# Altium schematic sheet 30to50V-24V_10A.SchDoc: 50V-24V Buck Converter @ 10A
size 279 x 215 mm; Date: 2023-07-16; CheckedBy: Logan Hartford; Engineer: Muhammad Tanveer; Revision: 1; SheetNumber: 1; SheetTotal: 1
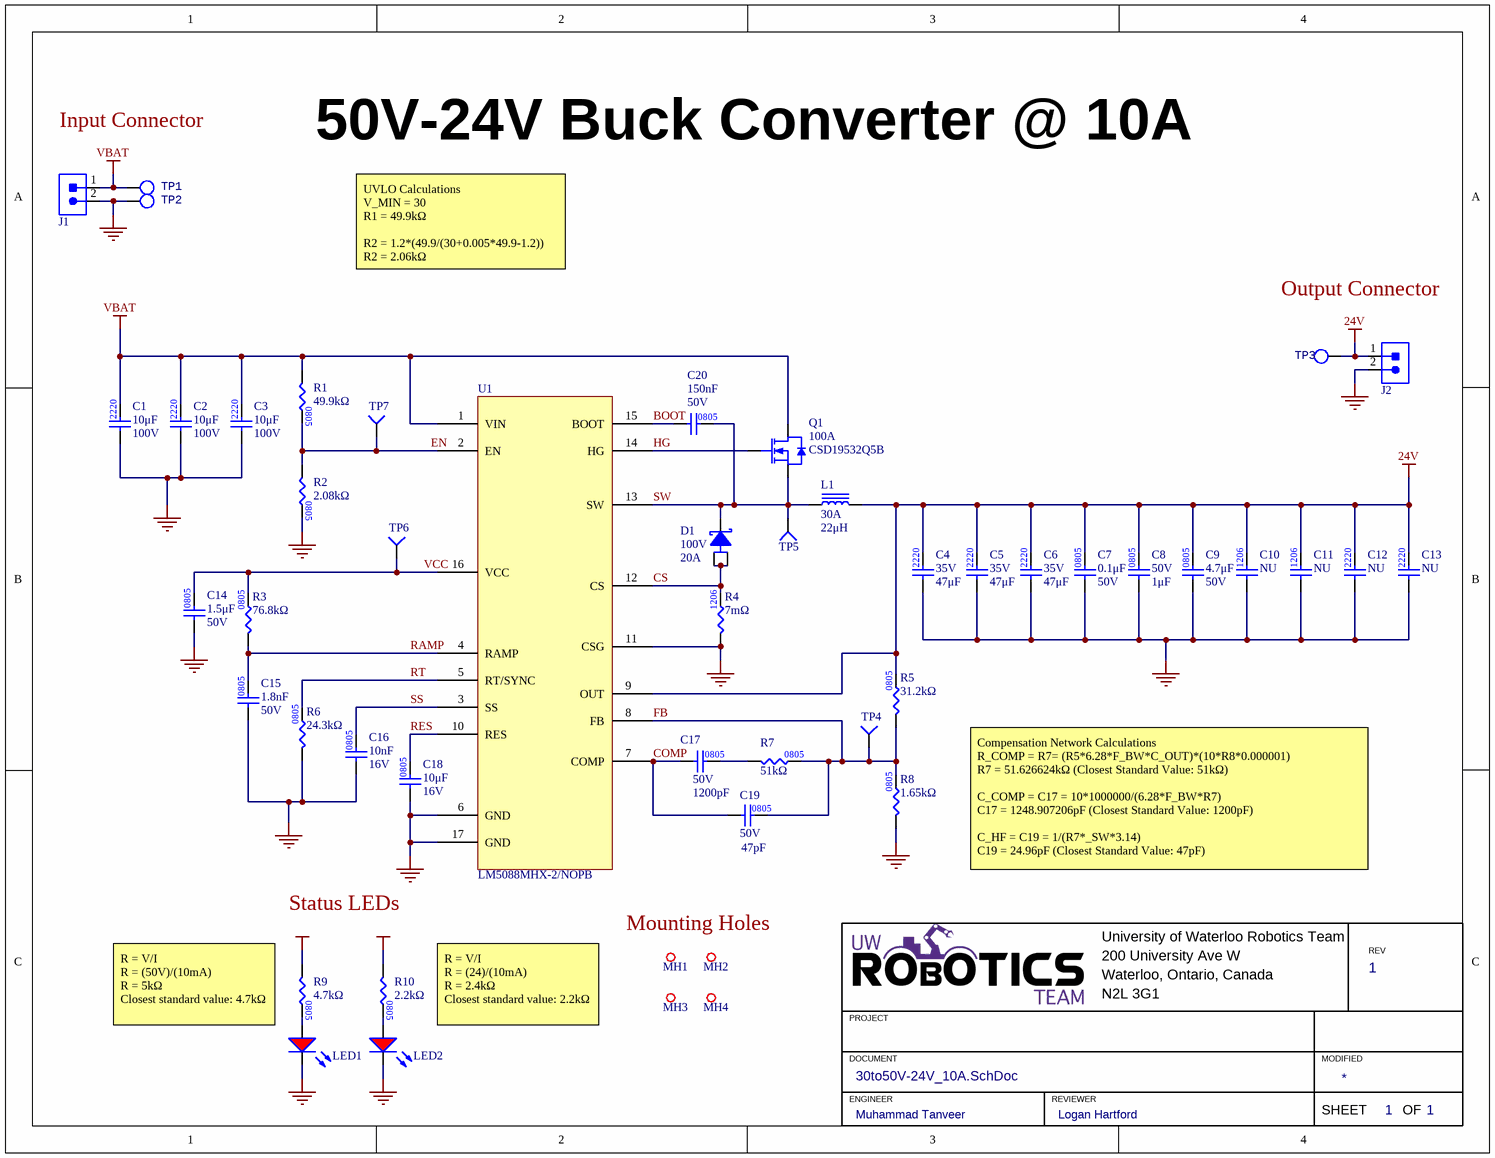
[diagram p0: 30to50V-24V_10A.SchDoc]

## Parts
C1  value 10μF  Voltage Rating: 100V  [CAP2220]  (hidden comment: CAP_10uF_50V_2220)
C2  value 10μF  Voltage Rating: 100V  [CAP2220]  (hidden comment: CAP_10uF_50V_2220)
C3  value 10μF  Voltage Rating: 100V  [CAP2220]  (hidden comment: CAP_10uF_50V_2220)
C4  value 47μF  Voltage Rating: 35V  [CAP2220]  (hidden comment: CAP_47uF_35V_2220)
C5  value 47μF  Voltage Rating: 35V  [CAP2220]  (hidden comment: CAP_47uF_35V_2220)
C6  value 47μF  Voltage Rating: 35V  [CAP2220]  (hidden comment: CAP_47uF_35V_2220)
C7  value 0.1μF  Voltage Rating: 50V  [CAP0805]  (hidden comment: CAP_0.1uF_50V_0805)
C8  value 1μF  Voltage Rating: 50V  [CAP0805]  (hidden comment: CAP_1uF_50V_0805)
C9  value 4.7μF  Voltage Rating: 50V  [CAP0805]  (hidden comment: CAP_4.7uF_50V_0805)
C10  value NU  [CAP1206]  (hidden comment: CAP_NU_1206)
C11  value NU  [CAP1206]  (hidden comment: CAP_NU_1206)
C12  value NU  [CAP2220]  (hidden comment: CAP_NU_2220)
C13  value NU  [CAP2220]  (hidden comment: CAP_NU_2220)
C14  value 1.5μF  Voltage Rating: 50V  [CAP0805]  (hidden comment: CAP_1.5uF_50V_0805)
C15  value 1.8nF  Voltage Rating: 50V  [CAP0805]  (hidden comment: CAP_1.8nF_50V_0805)
C16  value 10nF  Voltage Rating: 16V  [CAP0805]  (hidden comment: CAP_10nF_16V_0805)
C17  value 1200pF  Voltage Rating: 50V  [CAP0805]  (hidden comment: CAP_1200pF_50V_0805)
C18  value 10μF  Voltage Rating: 16V  [CAP0805]  (hidden comment: CAP_10uF_16V_0805)
C19  value 47pF  Voltage Rating: 50V  [CAP0805]  (hidden comment: CAP_47pF_50V_0805)
C20  value 150nF  Voltage Rating: 50V  [CAP0805]  (hidden comment: CAP_150nF_50V_0805)
D1  Vr (Max): 100V  Forward Current: 20A  [D2PAK (TO-263AB) - STPS20M100SG-TR]  (hidden comment: DIO_SCHOTTKY_100V_20A)
J1  CON_2POS_SCREW_TERM  [1935161]  (value not drawn)
J2  CON_2POS_SCREW_TERM  [1935161]  (value not drawn)
L1  Current Rating: 30A  Inductance: 22μH  [7443642200]  (hidden comment: IND_22uH_30A)
LED1  LED_RED  [LED_0805_RED]  (value not drawn)
LED2  LED_RED  [LED_0805_RED]  (value not drawn)
MH1  MOUNTING_HOLE_M3_GIMBAL_REV2  [MOUNTING_HOLE_3mm_GIMBAL_REV2]  (value not drawn)  (no BOM)
MH2  MOUNTING_HOLE_M3_GIMBAL_REV2  [MOUNTING_HOLE_3mm_GIMBAL_REV2]  (value not drawn)  (no BOM)
MH3  MOUNTING_HOLE_M3_GIMBAL_REV2  [MOUNTING_HOLE_3mm_GIMBAL_REV2]  (value not drawn)  (no BOM)
MH4  MOUNTING_HOLE_M3_GIMBAL_REV2  [MOUNTING_HOLE_3mm_GIMBAL_REV2]  (value not drawn)  (no BOM)
Q1  Id: 100A  Manufacturer Part Number 1: CSD19532Q5B  [8-VSON]  (hidden comment: NMOS_100V_100A)
R1  value 49.9kΩ  [RES0805]  (hidden comment: RES_49.9kΩ_0805_1%)
R2  value 2.08kΩ  [RES0805]  (hidden comment: RES_2.08kΩ_0805_0.05%)
R3  value 76.8kΩ  [RES0805]  (hidden comment: RES_76.8kΩ_0805_1%)
R4  value 7mΩ  [RES1206]  (hidden comment: RES_0.007Ω_1206_1%)
R5  value 31.2kΩ  [RES0805]  (hidden comment: RES_31.2KΩ_0805_0.1%)
R6  value 24.3kΩ  [RES0805]  (hidden comment: RES_24.3kΩ_0805_1%)
R7  value 51kΩ  [RES0805]  (hidden comment: RES_51kΩ_0805_5%)
R8  value 1.65kΩ  [RES0805]  (hidden comment: RES_1.65KΩ_0805_0.1%)
R9  value 4.7kΩ  [RES0805]  (hidden comment: RES_4.7kΩ_0805_5%)
R10  value 2.2kΩ  [RES0805]  (hidden comment: RES_2.2kΩ_0805_5%)
TP1  TESTPOINT_LOOP  [TESTPOINT_LOOP]  (value not drawn)
TP2  TESTPOINT_LOOP  [TESTPOINT_LOOP]  (value not drawn)
TP3  TESTPOINT_LOOP  [TESTPOINT_LOOP]  (value not drawn)
TP4  TESTPOINT_1MM_CIRCLE  [TESTPOINT_CIRCLE_1MM]  (value not drawn)  (no BOM)
TP5  TESTPOINT_1MM_CIRCLE  [TESTPOINT_CIRCLE_1MM]  (value not drawn)  (no BOM)
TP6  TESTPOINT_1MM_CIRCLE  [TESTPOINT_CIRCLE_1MM]  (value not drawn)  (no BOM)
TP7  TESTPOINT_1MM_CIRCLE  [TESTPOINT_CIRCLE_1MM]  (value not drawn)  (no BOM)
U1  LM5088  [LM5088]  (value not drawn)

## Nets
24V: C4.2 C5.2 C6.2 C7.2 C8.2 C9.2 C10.2 C11.2 C12.2 C13.2 J2.1 L1.2 R5.2 R10.1 TP3.1 U1.9(OUT)
GND: C1.1 C2.1 C3.1 C4.1 C5.1 C6.1 C7.1 C8.1 C9.1 C10.1 C11.1 C12.1 C13.1 C14.1 C15.1 C16.1 C18.1 J1.2 J2.2 LED1.2(K) LED2.2(K) R2.2 R4.1 R6.1 R8.1 TP2.1 U1.6(GND) U1.11(CSG) U1.17(GND)
VBAT: C1.2 C2.2 C3.2 J1.1 Q1.3(Drain) R1.1 R9.1 TP1.1 U1.1(VIN)
BOOT: C20.1 U1.15(BOOT)
COMP: C17.1 C19.1 U1.7(COMP)
CS: D1.1(Anode) D1.2(Anode) R4.2 U1.12(CS)
EN: R1.2 R2.1 TP7.1(=value) U1.2(EN)
FB: C19.2 R5.1 R7.2 R8.2 TP4.1(=value) U1.8(FB)
HG: Q1.1(Gate) U1.14(HG)
RAMP: C15.2 R3.1 U1.4(RAMP)
RES: C18.2 U1.10(RES)
RT: R6.2 U1.5(RT/SYNC)
SS: C16.2 U1.3(SS)
SW: C20.2 D1.3(Cathode) L1.1 Q1.2(Source) TP5.1(=value) U1.13(SW)
VCC: C14.2 R3.2 TP6.1(=value) U1.16(VCC)
NetC17_2: C17.2 R7.1
NetLED1_1: LED1.1(A) R9.2
NetLED2_1: LED2.1(A) R10.2

## Notes on the sheet
- Input Connector
- UVLO Calculations
  V_MIN = 30
  R1 = 49.9kΩ
  R2 = 1.2*(49.9/(30+0.005*49.9-1.2))
  R2 = 2.06kΩ
- Output Connector
- Status LEDs
- Compensation Network Calculations
  R_COMP = R7= (R5*6.28*F_BW*C_OUT)*(10*R8*0.000001)
  R7 = 51.626624kΩ (Closest Standard Value: 51kΩ)
  C_COMP = C17 = 10*1000000/(6.28*F_BW*R7)
  C17 = 1248.907206pF (Closest Standard Value: 1200pF)
  C_HF = C19 = 1/(R7*_SW*3.14)
  C19 = 24.96pF (Closest Standard Value: 47pF)
- Mounting Holes
- R = V/I
  R = (50V)/(10mA)
  R = 5kΩ
  Closest standard value: 4.7kΩ
- R = V/I
  R = (24)/(10mA)
  R = 2.4kΩ
  Closest standard value: 2.2kΩ
- University of Waterloo Robotics Team
- 200 University Ave W
- REV
- PROJECT
- Waterloo, Ontario, Canada
- N2L 3G1
- DOCUMENT
- ENGINEER
- REVIEWER
- MODIFIED
- SHEET
- OF
- (in symbol CAP_1.5uF_50V_0805) 0805
- (in symbol CAP_1.8nF_50V_0805) 0805
- (in symbol CAP_10nF_16V_0805) 0805
- (in symbol CAP_10uF_50V_2220) 2220
- (in symbol CAP_150nF_50V_0805) 0805
- (in symbol CAP_NU_2220) 2220
- (in symbol RES_51kΩ_0805_5%) 0805
- (in symbol RES_76.8kΩ_0805_1%) 0805

## Library data of the parts
C1-C3 = CAP_10uF_50V_2220: CAP CER 10UF 100V X7S 2220; Manufacturer 1: TDK Corporation; Manufacturer Part Number 1: C5750X7S2A106K230KB; Dielectric: X7S; Supplier 1: Digi-Key; Supplier Part Number 1: 445-13408-1-ND
C4-C6 = CAP_47uF_35V_2220: CAP CER 47UF 35V X7R 2220; Manufacturer 1: TDK Corporation; Manufacturer Part Number 1: CGA9N1X7R1V476M230KC; Package/Footprint: 2220; Supplier 1: Digi-Key; Supplier Part Number 1: 445-CGA9N1X7R1V476M230KCCT-ND; Mounting Type: SMD
C7 = CAP_0.1uF_50V_0805: CAP CER 0.1UF 50V X7R 0805; Manufacturer 1: Murata Electronics; Manufacturer Part Number 1: GCM21BR71H104KA37K; Package/Footprint: 0805; Mounting Type: SMD; Supplier 1: Digi-Key; Supplier Part Number 1: 490-8049-1-ND; Dielectric: X7R; LCSC Part #: C49678
C8 = CAP_1uF_50V_0805: CAP CER 1UF 50V X7R 0805; Manufacturer Part Number 1: CL21B105KBFNNNG; Manufacturer 1: Samsung Electro-Mechanics; Supplier Part Number 1: 1276-6470-1-ND; Supplier 1: Digi-Key; Mounting Type: SMD; LCSC Part #: C28323; Package: 0805
C9 = CAP_4.7uF_50V_0805: CAP CER 4.7UF 50V X5R 0805; Manufacturer 1: TDK Corporation; Manufacturer Part Number 1: CGA4J3X5R1H475K125AB; Mounting Type: SMD; Supplier 1: Digi-Key; Supplier Part Number 1: 445-7882-1-ND; Package: 0805; LCSC Part #: C1779; Dielectric: X5R
C10 C11 = CAP_NU_1206: PLACEHOLDER CAPACITOR; Mounting Type: Surface Mount; Package: 1206
C12 C13 = CAP_NU_2220: PLACEHOLDER CAPACITOR; Mounting Type: Surface Mount; Package: 1206
C14 = CAP_1.5uF_50V_0805: CAP CER 1.5UF 50V X7R 0805; Manufacturer Part Number 1: C2012X7R1H155K125AC; Manufacturer 1: TDK Corporation; Supplier Part Number 1: C2012X7R1H155K125AC; Supplier 1: Digi-Key; Dielectric: X7R
C15 = CAP_1.8nF_50V_0805: CAP CER 1800PF 50V C0G/NP0 0805; Manufacturer Part Number 1: GRM2165C1H182JA01D; Manufacturer 1: Murata Electronics; Dielectric: C0G; Supplier Part Number 1: 490-1626-1-ND; Supplier 1: Digi-Key
C16 = CAP_10nF_16V_0805: CAP CER 10000PF 16V X7R 0805; Manufacturer 1: Yageo; Manufacturer Part Number 1: AC0805KRX7R7BB103; Supplier 1: Digi-Key; Supplier Part Number 1: 311-3161-1-ND
C17 = CAP_1200pF_50V_0805: CAP CER 1200PF 50V X7R 0805; Manufacturer 1: KEMET; Manufacturer Part Number 1: C0805C122K5RAC7800; Package/Footprint: 0805; Supplier 1: Digi-Key; Supplier Part Number 1: 399-C0805C122K5RAC7800CT-ND
C18 = CAP_10uF_16V_0805: CAP CER 10UF 16V X5R 0805; Manufacturer 1: Yageo; Manufacturer Part Number 1: CC0805KKX5R7BB106; Package/Footprint: 0805; Mounting Type: SMD; Supplier 1: Digi-Key; Supplier Part Number 1: 311-1865-1-ND; Dielectric: X5R
C19 = CAP_47pF_50V_0805: CAP CER 47PF 50V C0G/NPO 0805; Manufacturer 1: YAGEO; Manufacturer Part Number 1: CC0805JRNPO9BN470; Package/Footprint: 0805; Dielectric: C0G; Supplier 1: Digi-Key; Mounting Type: SMD; Supplier Part Number 1: 311-1107-1-ND
C20 = CAP_150nF_50V_0805: CAP CER 0.15UF 50V X7R 0805; Manufacturer 1: Murata Electronics; Manufacturer Part Number 1: CC0603KRX7R9BB154; Supplier 1: Digi-Key; Dielectric: X7R; Supplier Part Number 1: GRM21BR71H154KA01L
D1 = DIO_SCHOTTKY_100V_20A: DIODE SCHOTTKY 100V 20A D2PAK; Manufacturer 1: STMicroelectronics; Manufacturer Part Number 1: STPS20M100SG-TR; Package/Footprint: TO-263AB; Mounting Type: SMD; Supplier 1: Digi-Key; Supplier Part Number 1: 497-10993-1-ND
J1 J2 = CON_2POS_SCREW_TERM: TERM BLK 2POS SIDE ENTRY 5MM; Manufacturer 1: Phoenix Contact; Package/Footprint: SMD; Supplier 1: Digi-Key; Mounting Type: TH; Supplier Part Number 1: 277-1667-ND; Manufacturer Part Number 1: 1935161
L1 = IND_22uH_30A: FIXED IND 22UH 30A 2.4 MOHM SMD; Manufacturer 1: Würth Elektronik; DC Resistance (DCR): 2.4mR; Inductance Tolerance: 15%; Saturation Current: 30A; Supplier 1: Digi-Key; Mounting Type: SMD; Manufacturer Part Number 1: 7443642200; Supplier Part Number 1: 732-5628-ND
LED1 LED2 = LED_RED: LED RED DIFFUSED 0805 SMD; Manufacturer 1: OSRAM; Manufacturer Part Number 1: LS R976-NR-1; Package/Footprint: 0805; Forward Voltage Drop: 2V; Supplier Part Number 1: 475-1278-1-ND; Supplier 1: Digi-Key; Mounting Type: SMD
MH1-MH4 = MOUNTING_HOLE_M3_GIMBAL_REV2: MOUNTING_HOLE_M3 Gimbal Rev2
Q1 = NMOS_100V_100A: MOSFET N-CH 100V 100A 8VSON; Manufacturer 1: Texas Instruments; Package/Footprint: 8-VSON-CLIP; Vgs (Max): ±20V; Supplier 1: Digi-Key; Supplier Part Number 1: 296-37478-1-ND; Mounting Type: SMD; Vdss: 100V
R1 = RES_49.9kΩ_0805_1%: RES 49.9K OHM 1% 1/8W 0805; Manufacturer 1: Vishay Dale; Manufacturer Part Number 1: TNPW080549K9BEEN; Package/Footprint: 0805; Supplier 1: Digi-Key; Mounting Type: SMD; Supplier Part Number 1: 541-3802-1-ND; LCSC Part #: C17719
R2 = RES_2.08kΩ_0805_0.05%: RES 2.08K OHM 0.05% 1/8W 0805; Manufacturer 1: KOA Speer Electronics, Inc.; Manufacturer Part Number 1: RN73R2ATTD2081A10; Package/Footprint: 0805; Supplier 1: Digi-Key; Mounting Type: SMD; Supplier Part Number 1: 2019-RN73R2ATTD2081A10CT-ND
R3 = RES_76.8kΩ_0805_1%: RES 76.8K OHM 1% 1/8W 0805; Manufacturer 1: Yageo; Manufacturer Part Number 1: RC0805FR-0776K8L; Supplier Part Number 1: 311-76.8KCRCT-ND; Supplier 1: Digi-Key
R4 = RES_0.007Ω_1206_1%: RES 0.007 OHM 1% 1W 1206; Manufacturer 1: Rohm Semiconductor; Manufacturer Part Number 1: PMR18EZPFU7L00; Package/Footprint: 1206; Mounting Type: SMD; Supplier 1: Digi-Key; Supplier Part Number 1: RHM.007ALCT-ND
R5 = RES_31.2KΩ_0805_0.1%: RES 31.2K OHM 0.1% 1/8W 0805; Manufacturer 1: Yageo; Manufacturer Part Number 1: RT0805BRD0731K2L; Supplier Part Number 1: 13-RT0805BRD0731K2LCT-ND; Supplier 1: Digi-Key; Mounting Type: SMD; Package: 0805
R6 = RES_24.3kΩ_0805_1%: RES 24.3K OHM 1% 1/8W 0805; Manufacturer 1: YAGEO; Manufacturer Part Number 1: RC0805FR-0724K3L; Power: 0.125W; Package: 0805; Tolerance: 1%; Supplier 1: Future Electronics
R7 = RES_51kΩ_0805_5%: RES 51K OHM 1% 1/8W 0805; Manufacturer 1: Vishay Dale; Manufacturer Part Number 1: CRCW080551K0FKEA; Supplier 1: Digi-Key; Supplier Part Number 1: 541-51.0KCCT-ND
R8 = RES_1.65KΩ_0805_0.1%: RES 1.65K OHM 0.1% 1/4W 0805; Manufacturer 1: KOA Speer Electronics, Inc.; Manufacturer Part Number 1: RS73F2ATTD1651B; Supplier Part Number 1: 2019-RS73F2ATTD1651BCT-ND; Supplier 1: Digi-Key; Mounting Type: SMD; Package: 0805
R9 = RES_4.7kΩ_0805_5%: RES 4.7K OHM 5% 1/8W 0805; Manufacturer 1: Yageo; Manufacturer Part Number 1: RC0805JR-074K7L; Supplier 1: Digi-Key; Supplier Part Number 1: 311-4.7KARCT-ND; Mounting Type: SMD; LCSC Part #: C17673; Package: 0805
R10 = RES_2.2kΩ_0805_5%: RES 2.2K OHM 5% 1/8W 0805; Manufacturer 1: Vishay Dale; Manufacturer Part Number 1: CRCW08052K20JNEAC; Supplier 1: Digi-Key; Supplier Part Number 1: 541-4169-1-ND; Tolerance: 5%; Package: 0805
TP1-TP3 = TESTPOINT_LOOP: TESTPOINT THRUHOLE; Manufacturer 1: Keystone Electronics; Manufacturer Part Number 1: 5002; Package/Footprint: TH; Supplier Part Number 1: 36-5002-ND; Supplier 1: Digi-Key; Mounting Type: TH
TP4-TP7 = TESTPOINT_1MM_CIRCLE: TESTPOINT 1MM CIRCLE
U1 = LM5088MHX-2/NOPB: IC REG CTRLR BUCK 16HTSSOP; Manufacturer 1: Texas Instruments; Supply Voltage: 4.5V - 75V; Switching Frequency: 50kHz - 1MHz; Supplier 1: Digi-Key; Supplier Part Number 1: 296-35302-1-ND; Package: 16-HTSSOP; Manufacturer Part Number 1: LM5088MHX-2/NOPB